# Altium schematic sheet CFS210017030ZZP2005A0.SchDoc
size A2; SheetNumber: 1; SheetTotal: 1
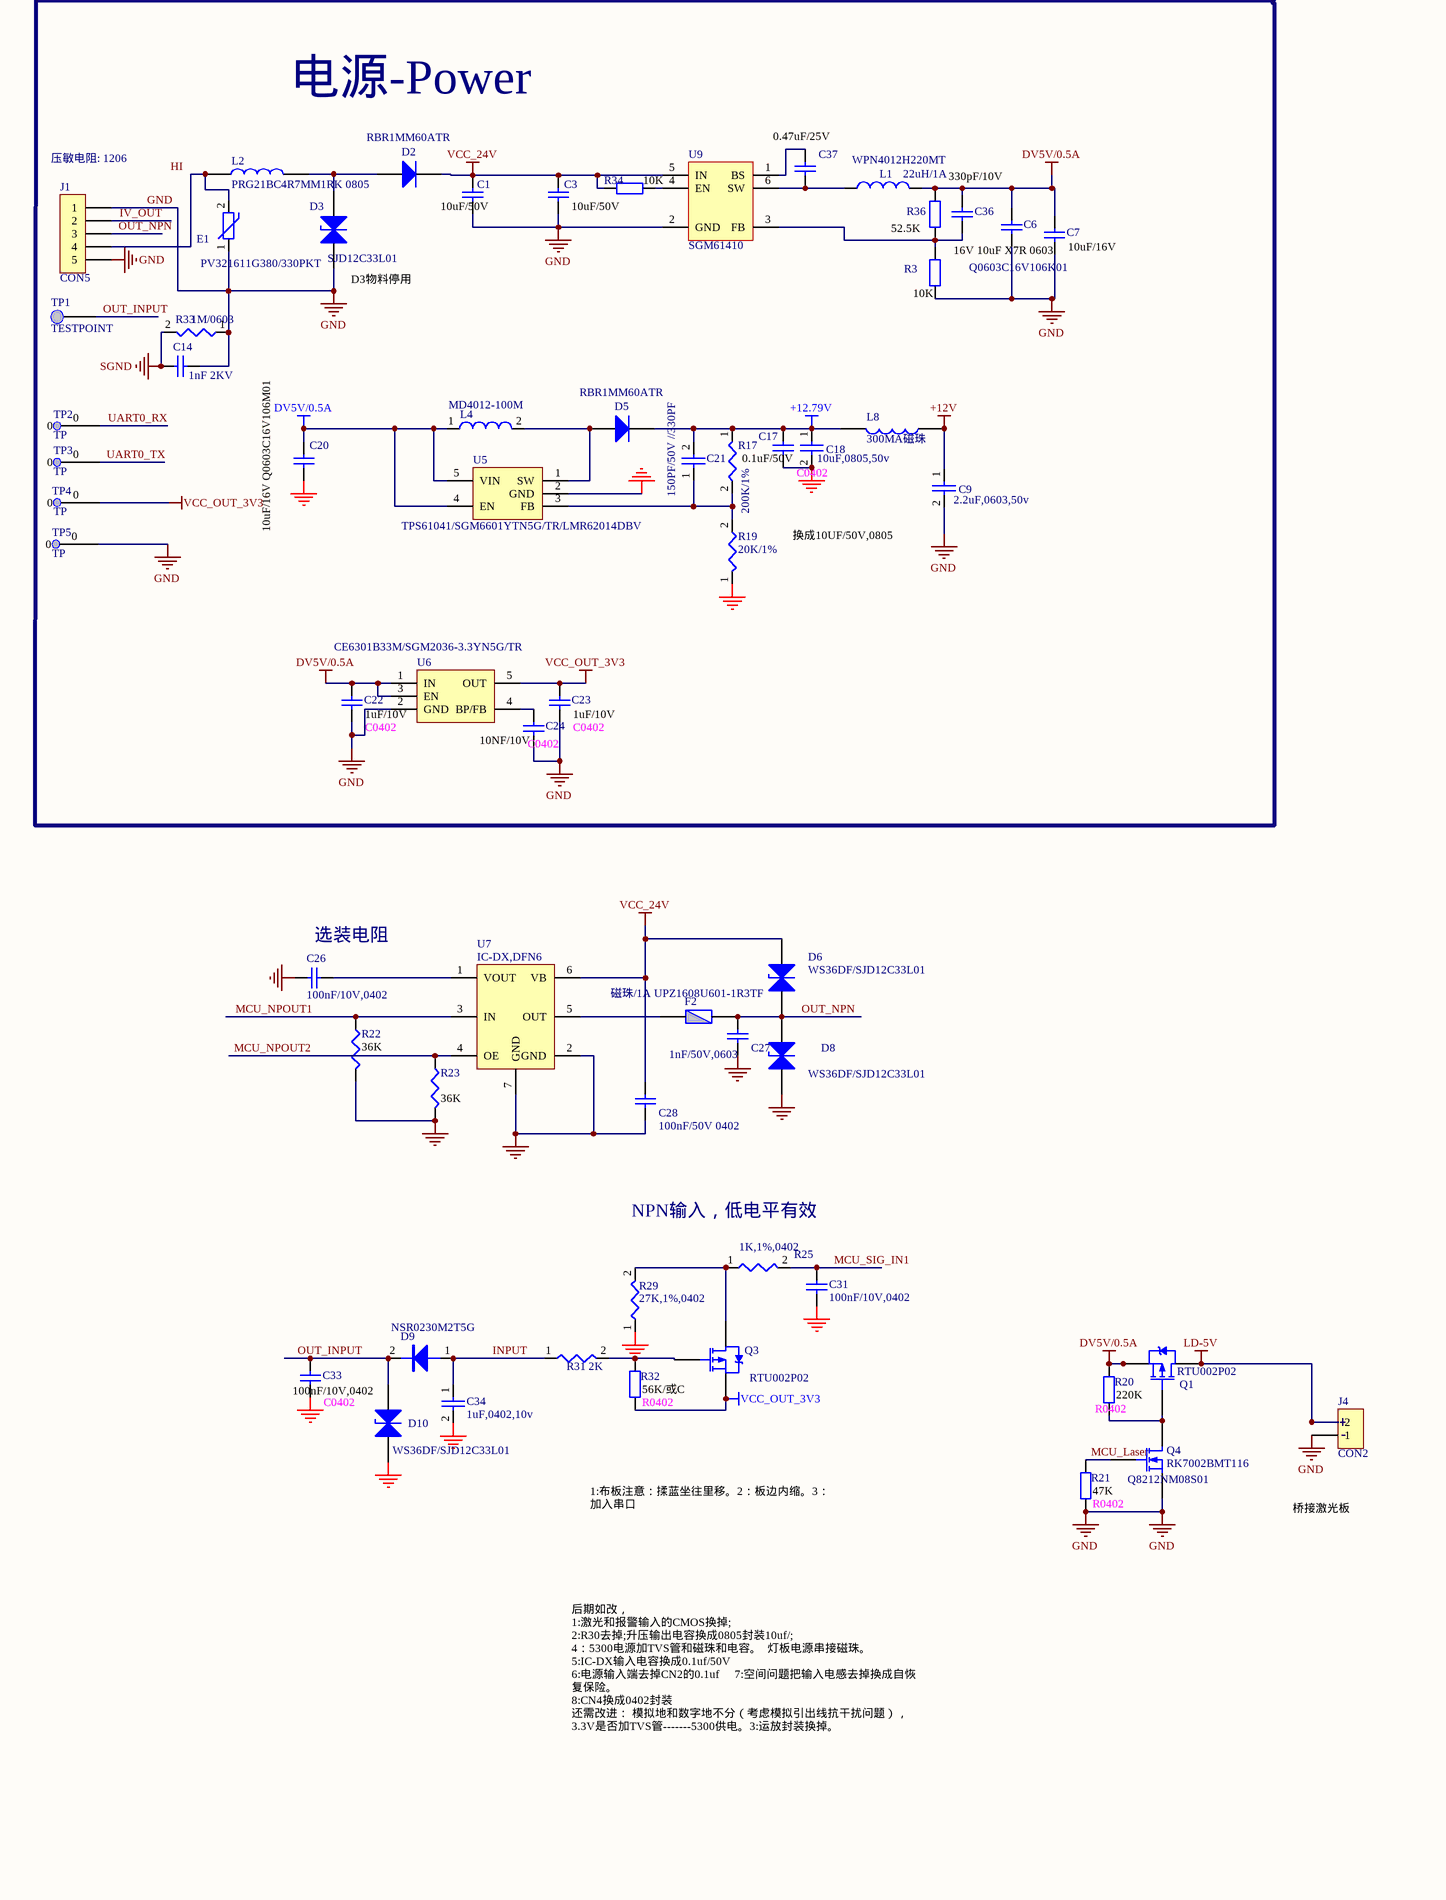
[diagram p0: CFS210017030ZZP2005A0.SchDoc, left]
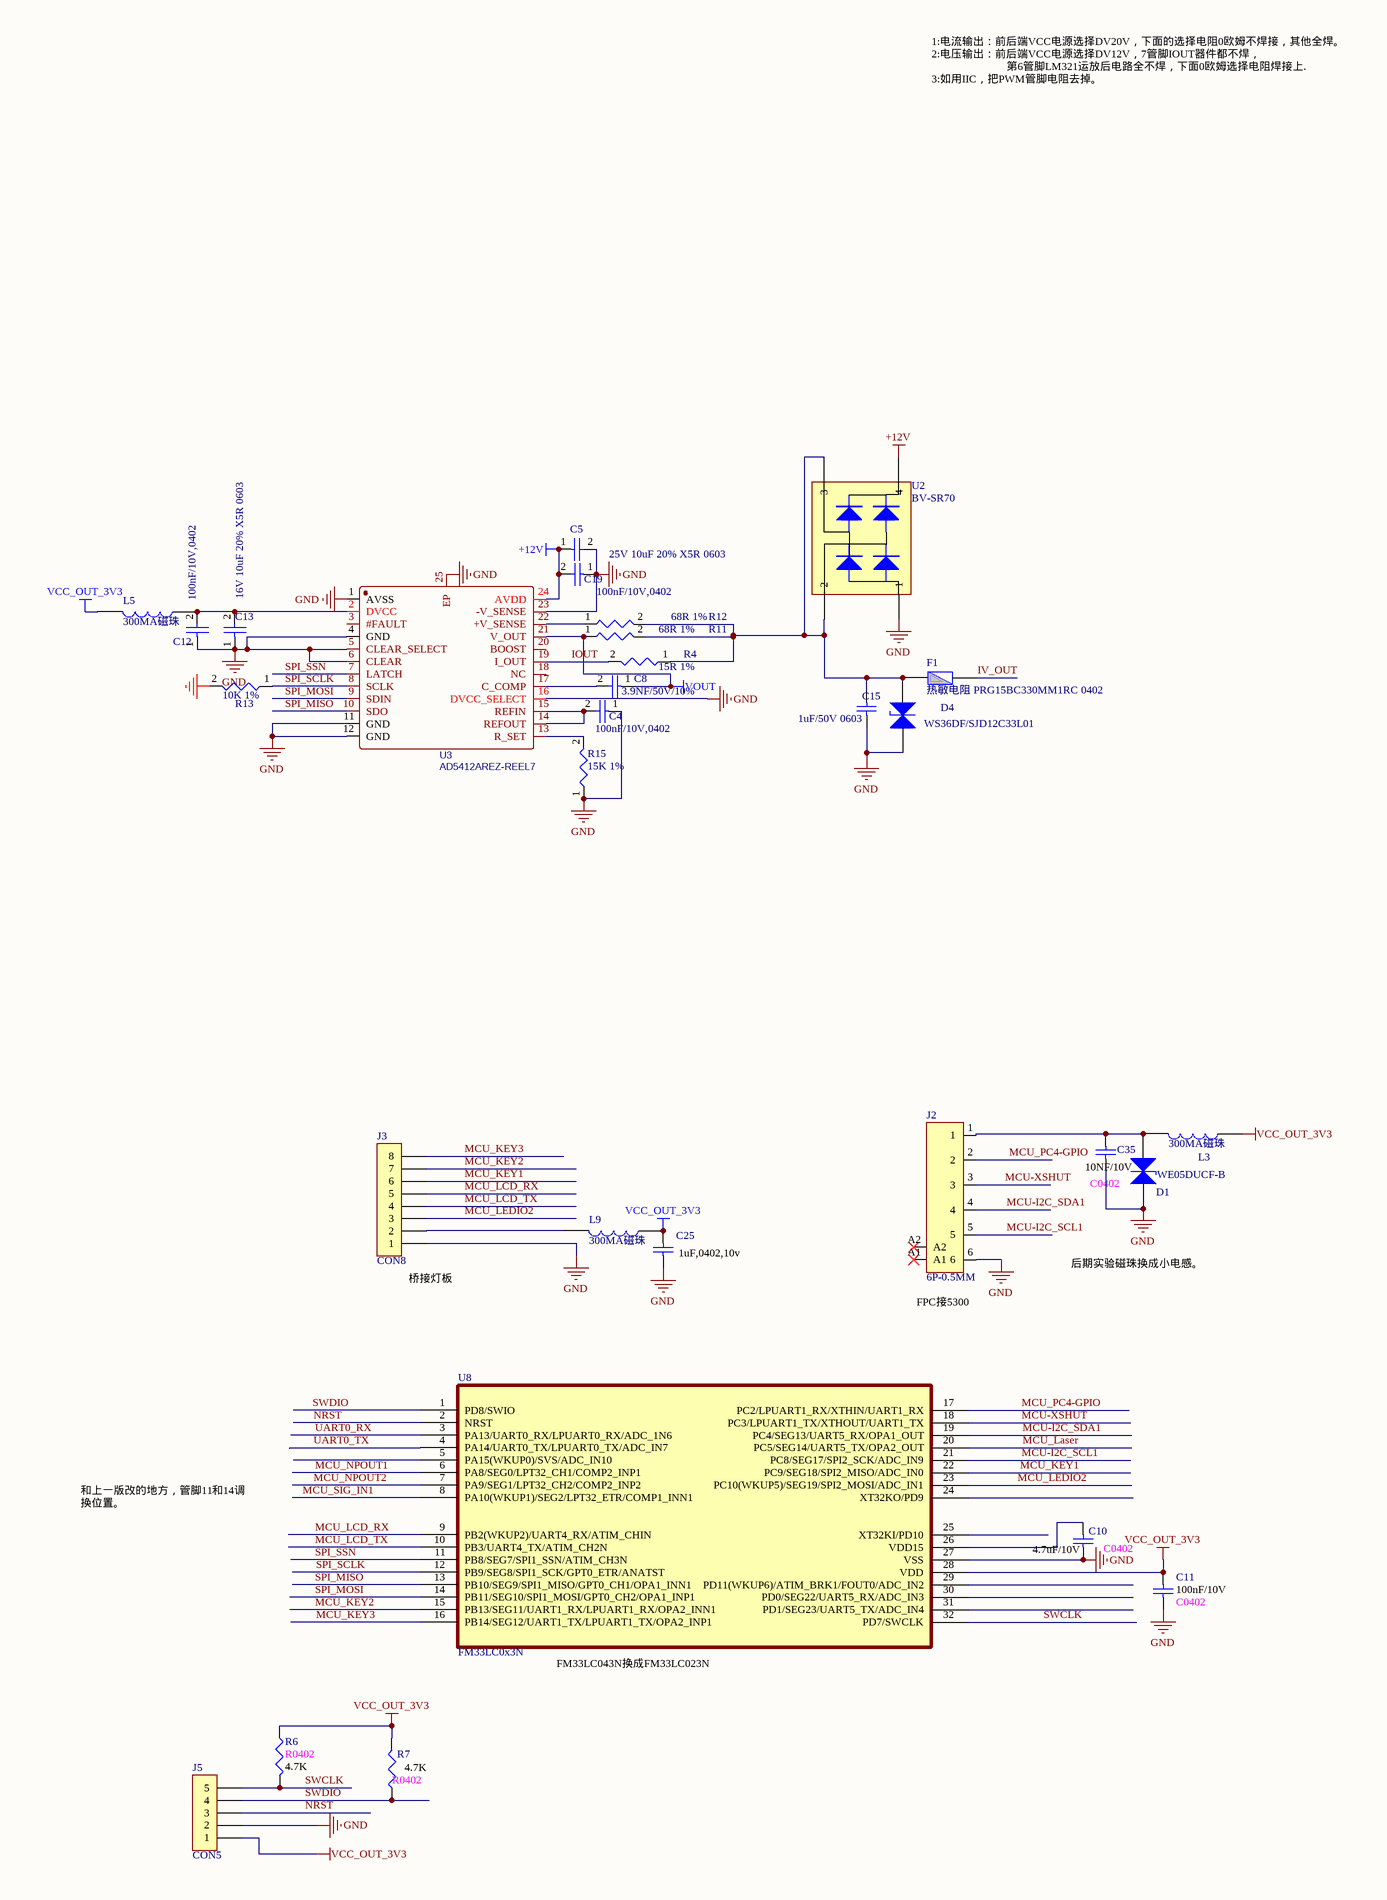
[diagram p1: CFS210017030ZZP2005A0.SchDoc, right]

## Parts
C1  value 10uF/50V  [R0805-Z]  (hidden comment: Q0402C50V223K01)
C3  value 10uF/50V  [R0805-Z]  (hidden comment: Q0402C50V223K01)
C4  100nF/10V,0402  [R0402-Z]
C5  25V 10uF 20% X5R 0603  [R0603-Z]
C6  Q0603C16V106K01  value 16V 10uF X7R 0603  [R0603-Z]
C7  value 10uF/16V  [R0603-Z]  (hidden comment: Q0603C16V106K01)
C8  3.9NF/50V/10%  [R0402-Z]
C9  2.2uF,0603,50v  [R0603-Z]
C10  PackageReference: C0402  [R0402-Z]  (hidden comment: 4.7uF/10V)
C11  value 100nF/10V  PackageReference: C0402  [R0402-Z]  (hidden comment: 100nF/10V,0402)
C12  100nF/10V,0402  [R0402-Z]
C13  16V 10uF 20% X5R 0603  [R0603-Z]
C14  1nF 2KV  [CR3216-1206]
C15  1uF/50V 0603  [R0603-Z]
C17  value 0.1uF/50V  PackageReference: C0402  [R0402-Z]  (hidden comment: Q0402C50V223K01)
C18  10uF,0805,50v  [R0805-Z]
C19  100nF/10V,0402  [R0402-Z]
C20  value 10uF/16V Q0603C16V106M01  [R0603-Z]  (hidden comment: Q0603C16V106K01)
C21  150PF/50V //330PF  [R0402-Z]
C22  value 1uF/10V  PackageReference: C0402  [R0402-Z]  (hidden comment: Q0402C50V223K01)
C23  value 1uF/10V  PackageReference: C0402  [R0402-Z]  (hidden comment: Q0402C50V223K01)
C24  value 10NF/10V  PackageReference: C0402  [R0402-Z]  (hidden comment: Q0402C50V223K01)
C25  1uF,0402,10v  [R0402-Z]
C26  100nF/10V,0402  [R0402-Z]
C27  1nF/50V,0603  [R0603-Z]
C28  100nF/50V 0402  [R0402-Z]
C31  100nF/10V,0402  [R0402-Z]
C33  value 100nF/10V,0402  PackageReference: C0402  [R0402-Z]  (hidden comment: Q0402C50V223K01)
C34  1uF,0402,10v  [R0402-Z]
C35  value 10NF/10V  PackageReference: C0402  [R0402-Z]  (hidden comment: Q0402C50V223K01)
C36  value 330pF/10V  [R0402-Z]  (hidden comment: Q0402C50V223K01)
C37  value 0.47uF/25V  [R0402-Z]  (hidden comment: Q0402C50V223K01)
D1  WE05DUCF-B  [WS36DF]
D2  RBR1MM60ATR  [SOD-123Z]
D3  SJD12C33L01  [SOD-123S]
D4  WS36DF/SJD12C33L01  [WS36DF]
D5  RBR1MM60ATR  [SOD-123Z]
D6  WS36DF/SJD12C33L01  [WS36DF]
D8  WS36DF/SJD12C33L01  [WS36DF]
D9  NSR0230M2T5G  [SOD723]
D10  WS36DF/SJD12C33L01  [WS36DF]
E1  PV321611G380/330PKT  压敏电阻: 1206  [FPV3216]
F1  热敏电阻 PRG15BC330MM1RC 0402  [R0402-Z]
F2  磁珠/1A UPZ1608U601-1R3TF  [R0603-Z]
J1  CON5  [CON1.695-5]
J2  6P-0.5MM  [FPC-0.5-6]
J3  CON8  [CON8-QIAOJIE]
J4  CON2  [JIGUANGQIAO]
J5  CON5  [PH1.27-5]
L1  WPN4012H220MT  value 22uH/1A  [WPN4012H220MT]
L2  PRG21BC4R7MM1RK 0805  [R0805-Z]
L3  300MA磁珠  [R0402-Z]
L4  10UH或12UH/1..3A以上  [MD4012-100M]  (value not drawn)
L5  300MA磁珠  [R0402-Z]
L8  300MA磁珠  [R0402-Z]
L9  300MA磁珠  [R0402-Z]
Q1  RTU002P02  [SOT-323]
Q3  RTU002P02  [SOT-323]
Q4  RK7002BMT116  [SOT-23]
R3  10K  [R0402-Z]
R4  15R 1%  [R0402-Z]
R6  PackageReference: R0402  [R0402-Z]  (hidden comment: 4.7K)
R7  PackageReference: R0402  [R0402-Z]  (hidden comment: 4.7K)
R11  68R 1%  [R0402-Z]
R12  68R 1%  [R0402-Z]
R13  10K 1%  [R0402-Z]
R15  15K 1%  [R0402-Z]
R17  200K/1%  [R0402-Z]
R19  20K/1%  [R0402-Z]
R20  PackageReference: R0402  [R0402-Z]  (hidden comment: 220K)
R21  PackageReference: R0402  [R0402-Z]  (hidden comment: 47K)
R22  36K  [R0402-Z]
R23  36K  [R0402-Z]
R25  1K,1%,0402  [R0402-Z]
R29  27K,1%,0402  [R0402-Z]
R31  2K  [R0402-Z]
R32  value 56K/或C  PackageReference: R0402  [R0402-Z]  (hidden comment: 56K)
R33  1M/0603  [R0603-Z]
R34  10K  [R0402-Z]
R36  52.5K  [R0402-Z]
TP1  TESTPOINT  [TP1-1]
TP2  TP  [TP1]
TP3  TP  [TP1]
TP4  TP  [TP1]
TP5  TP  [TP1]
U2  BV-SR70  [CD143A]
U3  AD5412AREZ-REEL7  [AD5422]
U5  TPS61041/SGM6601YTN5G/TR/LMR62014DBV  [SOT23-5-LMR62014]
U6  CE6301B33M/SGM2036-3.3YN5G/TR  [SOT23-5]
U7  IC-DX,DFN6  [IC-DX]
U8  FM33LC0x3N  [QFN32]
U9  SGM61410  [SOT23-6-Z]

## Nets
+12.79V: C17.2 C18.1 C21.2 D5.2(K) L8.2 R17.1
+12V: C5.1 C9.1 C19.2 L8.1 U2.4 U3.24(AVDD)
DV5V/0.5A: C6.2 C7.2 C20.2 C22.2 C36.2 L1.2 L4.1 Q1.2(S) R20.2 R36.2 U5.4(EN) U5.5(VIN) U6.1(IN) U6.3(EN)
GND: C1.1 C3.1 C4.1 C5.2 C6.1 C7.1 C9.2 C10.1 C11.1 C12.1 C13.1 C14.1 C15.2 C17.1 C18.2 C19.1 C20.1 C22.1 C23.1 C24.1 C25.1 C26.1 C27.1 C28.1 C31.1 C33.1 C34.2 C35.1 D1.1(A) D3.2(K) D4.2(K) D8.2(K) D10.2(K) E1.1 J1.1 J1.5 J2.6 J3.1 J4.1 J5.2 Q4.3(S) R3.1 R13.2 R15.1 R19.1 R21.1 R22.2 R23.2 R29.1 R33.1 TP5.0 U2.1 U3.1(AVSS) U3.4(GND) U3.5(CLEAR_SELECT) U3.6(CLEAR) U3.11(GND) U3.12(GND) U3.16(DVCC_SELECT) U3.23(-V_SENSE) U3.25(EP) U5.2(GND) U6.2(GND) U7.2(GND) U7.7(GND) U8.27(VSS) U9.2(GND)
LD-5V: J4.2 Q1.3(D)
SGND: C14.2 R33.2
VCC_24V: C1.2 C3.2 C28.2 D2.2(K) D6.1(A) R34.2 U7.6(VB) U9.5(IN)
VCC_OUT_3V3: C11.2 C23.2 C25.2 J5.1 L3.1 L5.2 L9.1 Q3.2(S) R6.1 R7.2 R32.1 TP4.0 U6.5(OUT) U8.28(VDD)
VOUT: C8.1 R11.1 U3.21(V_OUT)
INPUT: C34.1 D9.1(A) R31.1
IOUT: R4.2 U3.19(I_OUT)
IV_OUT: F1.1 J1.2
MCU-I2C_SCL1: J2.5 U8.21(PC8/SEG17/SPI2_SCK/ADC_IN9)
MCU-I2C_SDA1: J2.4 U8.19(PC4/SEG13/UART5_RX/OPA1_OUT)
MCU-XSHUT: J2.3 U8.18(PC3/LPUART1_TX/XTHOUT/UART1_TX)
MCU_KEY1: J3.6 U8.22(PC9/SEG18/SPI2_MISO/ADC_IN0)
MCU_KEY2: J3.7 U8.15(PB13/SEG11/UART1_RX/LPUART1_RX/OPA2_INN1)
MCU_KEY3: J3.8 U8.16(PB14/SEG12/UART1_TX/LPUART1_TX/OPA2_INP1)
MCU_Laser: Q4.2(G) R21.2 U8.20(PC5/SEG14/UART5_TX/OPA2_OUT)
MCU_LCD_RX: J3.5 U8.9(PB2(WKUP2)/UART4_RX/ATIM_CHIN)
MCU_LCD_TX: J3.4 U8.10(PB3/UART4_TX/ATIM_CH2N)
MCU_LEDIO2: J3.3 U8.23(PC10(WKUP5)/SEG19/SPI2_MOSI/ADC_IN1)
MCU_NPOUT1: R22.1 U7.3(IN) U8.6(PA8/SEG0/LPT32_CH1/COMP2_INP1)
MCU_NPOUT2: R23.1 U7.4(OE) U8.7(PA9/SEG1/LPT32_CH2/COMP2_INP2)
MCU_PC4-GPIO: J2.2 U8.17(PC2/LPUART1_RX/XTHIN/UART1_RX)
MCU_SIG_IN1: C31.2 R25.2 U8.8(PA10(WKUP1)/SEG2/LPT32_ETR/COMP1_INN1)
NRST: J5.3 U8.2(NRST)
OUT_INPUT: C33.2 D9.2(K) D10.1(A) TP1.1
OUT_NPN: C27.2 D6.2(K) D8.1(A) F2.1 J1.3
SPI_MISO: U3.10(SDO) U8.13(PB10/SEG9/SPI1_MISO/GPT0_CH1/OPA1_INN1)
SPI_MOSI: U3.9(SDIN) U8.14(PB11/SEG10/SPI1_MOSI/GPT0_CH2/OPA1_INP1)
SPI_SCLK: R13.1 U3.8(SCLK) U8.12(PB9/SEG8/SPI1_SCK/GPT0_ETR/ANATST)
SPI_SSN: U3.7(LATCH) U8.11(PB8/SEG7/SPI1_SSN/ATIM_CH3N)
SWCLK: J5.5 R6.2 U8.32(PD7/SWCLK)
SWDIO: J5.4 R7.1 U8.1(PD8/SWIO)
UART0_RX: TP2.0 U8.3(PA13/UART0_RX/LPUART0_RX/ADC_1N6)
UART0_TX: TP3.0 U8.4(PA14/UART0_TX/LPUART0_TX/ADC_IN7)
NetC4_2: C4.2 U3.14(REFOUT) U3.15(REFIN)
NetC8_2: C8.2 U3.17(C_COMP)
NetC10_2: C10.2 U8.26(VDD15)
NetC12_2: C12.2 C13.2 L5.1 U3.2(DVCC)
NetC15_1: C15.1 D4.1(A) F1.2 R4.1 R11.2 R12.2 U2.2 U2.3
NetC21_1: C21.1 R17.2 R19.2 U5.3(FB)
NetC24_2: C24.2 U6.4(BP/FB)
NetC26_2: C26.2 U7.1(VOUT)
NetC35_2: C35.2 D1.2(K) J2.1 L3.2
NetC36_1: C36.1 R3.2 R36.1 U9.3(FB)
NetC37_1: C37.1 U9.1(BS)
NetC37_2: C37.2 L1.1 U9.6(SW)
NetD2_1: D2.1(A) D3.1(A) L2.2
NetD5_1: D5.1(A) L4.2 U5.1(SW)
NetE1_2: E1.2 J1.4 L2.1
NetF2_2: F2.2 U7.5(OUT)
NetJ3_2: J3.2 L9.2
NetQ1_1: Q1.1(G) Q4.1(D) R20.1
NetQ3_1: Q3.1(G) R31.2 R32.2
NetQ3_3: Q3.3(D) R25.1 R29.2
NetR12_1: R12.1 U3.22(+V_SENSE)
NetR15_2: R15.2 U3.13(R_SET)
NetR34_1: R34.1 U9.4(EN)

Not connected (* = marked no-connect by the designer): J2 A1* A2*; U3 3(#FAULT) 18(NC) 20(BOOST); U8 5(PA15(WKUP0)/SVS/ADC_IN10) 24(XT32KO/PD9) 25(XT32KI/PD10) 29(PD11(WKUP6)/ATIM_BRK1/FOUT0/ADC_IN2) 30(PD0/SEG22/UART5_RX/ADC_IN3) 31(PD1/SEG23/UART5_TX/ADC_IN4)

## Notes on the sheet
- 1:电流输出：前后端VCC电源选择DV20V，下面的选择电阻0欧姆不焊接，其他全焊。
  2:电压输出：前后端VCC电源选择DV12V，7管脚IOUT器件都不焊，
  第6管脚LM321运放后电路全不焊，下面0欧姆选择电阻焊接上.
  3:如用IIC，把PWM管脚电阻去掉。
- 电源-Power
- (near D3) D3物料停用
- +13V
- (near L8) +13V
- 换成10UF/50V,0805封装
- (near C26) 选装电阻
- NPN输入，低电平有效
- (near J3) 桥接灯板
- (near J2) FPC接5300
- 后期实验磁珠换成小电感。
- 1:布板注意：揉蓝坐往里移。2：板边内缩。3：加入串口
- 桥接激光板
- 和上一版改的地方，管脚11和14调换位置。
- (near U8) FM33LC043N换成FM33LC023N
- 后期如改，                                                                                                                                  1:激光和报警输入的CMOS换掉;                                                                                                                2:R30去掉;升压输出电容换成0805封装10uf/;                                                                                                                                                                 4：5300电源加TVS管和磁珠和电容。  灯板电源串接磁珠。                                                                                                  5:IC-DX输入电容换成0.1uf/50V                                                                                                   6:电源输入端去掉CN2的0.1uf     7:空间问题把输入电感去掉换成自恢复保险。                                                                                                                                                                                                              8:CN4换成0402封装                                                                                                                          还需改进： 模拟地和数字地不分（考虑模拟引出线抗干扰问题），3.3V是否加TVS管-------5300供电。3:运放封装换掉。
- Labels drawn without touching a wire or pin: HI
- (in symbol INDUCTOR) MD4012-100M
- (in symbol MOSFET-N) Q8212NM08S01

## Library data of the parts
C1 C3 C6 C7 C17 C20 C22-C24 C33 C35-C37 = Cap: Capacitor; LatestRevisionDate: 17-Jul-2002; LatestRevisionNote: Re-released for DXP Platform.; Publisher: Altium Limited; PackageDescription: Radial Cap, Thru-Hole; 2 Leads; 0.3 in Pin Spacing
  C1 C3 C7 C20: PackageReference: C0805
  C6 C37: PackageReference: C0603
  C36: PackageReference: C0402
C4 C5 C8 C9 C12 C13 C18 C19 C21 C34 = CAP: Capacitor
C10 C11 C25 = Cap Semi: Capacitor (Semiconductor SIM Model); Published: 8-Jun-2000; LatestRevisionDate: 29-May-2009; LatestRevisionNote: IPC-7351 Footprint Added.; Publisher: Altium Limited; PackageDescription: Chip Capacitor
  C10: Value: 4.7uF/10V
  C25: PackageReference: C0603; Value: 1uF,0402,10v
C14 = Cap: Capacitor; Value: 100nF/10V; LatestRevisionDate: 17-Jul-2002; LatestRevisionNote: Re-released for DXP Platform.; PackageReference: C0402; Publisher: Altium Limited; PackageDescription: Radial Cap, Thru-Hole; 2 Leads; 0.3 in Pin Spacing
C15 = Cap: Published: 8-Jun-2000; LatestRevisionDate: 17-Jul-2002; LatestRevisionNote: Re-released for DXP Platform.; PackageReference: RAD-0.3; Publisher: Altium Limited; PackageDescription: Radial Cap, Thru-Hole; 2 Leads; 0.3 in Pin Spacing; Value: 1uF/50V 0603
C26 C31 = Cap: Capacitor; Value: 100nF/16V,0402; LatestRevisionDate: 17-Jul-2002; LatestRevisionNote: Re-released for DXP Platform.; PackageReference: C0402; Publisher: Altium Limited; PackageDescription: Radial Cap, Thru-Hole; 2 Leads; 0.3 in Pin Spacing
C27 C28 = Cap: Capacitor; Value: 1nF/50V,0402; LatestRevisionDate: 17-Jul-2002; LatestRevisionNote: Re-released for DXP Platform.; PackageReference: C0402; Publisher: Altium Limited; PackageDescription: Radial Cap, Thru-Hole; 2 Leads; 0.3 in Pin Spacing
D1 D3 D4 D6 D8 D10 = PSD36C
D2 D5 = Diode: Default Diode; Published: 8-Jun-2000; LatestRevisionDate: 17-Jul-2002; LatestRevisionNote: Re-released for DXP Platform.; PackageVersion: Sep-1996; PackageReference: SOD123; Publisher: Altium Limited; PackageDescription: SMA; Code_JEDEC: DO-214-AB
D9 = DIODE
E1 = VARISTOR: PV321611G380PKT
F1 F2 = PTC: 自恢复保险
J1 = CON5: Connector
J2 = 6PIN_1
J3 = CON8: Connector; Manufacturer: 津达电子; Show: CON8
J4 = CON2: Connector
J5 = CON5: Connector; Manufacturer: 津达电子; Show: CON5
L1 = Inductor: Code_IEC: 1005; Published: 8-Jun-2000; LatestRevisionDate: 29-May-2009; LatestRevisionNote: IPC-7351 Footprint Added.; PackageReference: L2520; Publisher: Altium Limited; PackageDescription: Chip Inductor; Code_JEITA: 0402
L2 L3 L5 L8 L9 = INDUCTOR1
L4 = INDUCTOR
Q1 Q3 = PMOS-2: P-Channel Power MOSFET; Note: Pin 4 not drawn and electrically connected to Pin 2.; Published: 8-Jun-2000; LatestRevisionDate: 17-Jul-2002; LatestRevisionNote: Re-released for DXP Platform.; DatasheetVersion: PD-9.390D; PackageReference: TO-220AB; Publisher: Altium Limited; Code_JEDEC: TO-220-AB; ComponentLink1Description: Manufacturer Link; ComponentLink1URL: http://www.irf.com/
Q4 = MOSFET-N: N-Channel MOSFET; pin to pad: 1>3 2>1 3>2; Published: 8-Jun-2000; LatestRevisionDate: 17-Jul-2002; LatestRevisionNote: Re-released for DXP Platform.; PackageVersion: 1995/1996; PackageReference: E3; Publisher: Altium Limited
R3 R20 R21 R32 R34 R36 = Res2: Resistor; Published: 8-Jun-2000; LatestRevisionDate: 17-Jul-2002; LatestRevisionNote: Re-released for DXP Platform.; Publisher: Altium Limited; PackageDescription: Axial Device, Thru-Hole; 2 Leads; 0.4 in Pin Spacing
  R3 R34: PackageReference: R0402; Value: 10K
  R20: Value: 220K
  R21: Value: 47K
  R36: PackageReference: R0402; Value: 52.5K
R4 R11-R13 R15 R17 R19 R25 R29 R31 R33 = RES1
R6 R7 R22 R23 = Res3: Resistor; Published: 8-Jun-2000; LatestRevisionDate: 29-May-2009; LatestRevisionNote: IPC-7351 Footprint Added.; Publisher: Altium Limited; PackageDescription: Chip Resistor
  R6 R7: Value: 4.7K
  R22 R23: PackageReference: R0402; Value: 36K
U2 = CD143A
U3 = AD5412AREZ-REEL7: BOM_Manufacturer: ADI; BOM_Supplier: LCSC; BOM_Manufacturer Part: AD5412AREZ-REEL7; BOM_Supplier Part: C27993; BOM_JLCPCB Part Class: Extended Part; spicePre: U; spiceSymbolName: AD5412AREZ-REEL7
U5 = TPS61041
U6 = SGM2036-3.3YN5G/TR
U7 = IC-DX
U9 = HM2459B